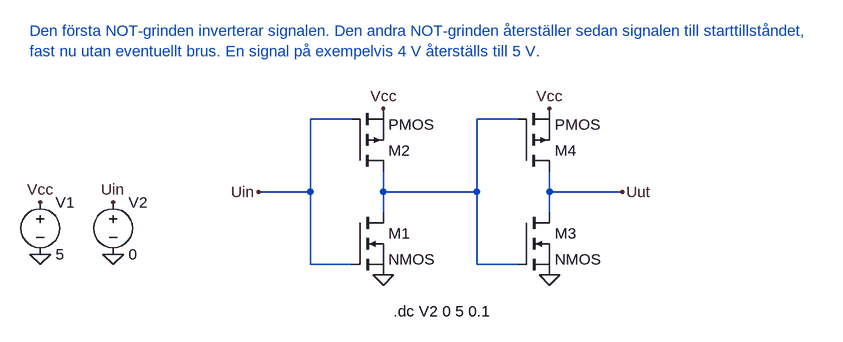
[diagram p0: schematic buffer.asc]
buffer.asc, the LTspice schematic file:
Version 4.1
SHEET 1 1132 680
WIRE 144 32 80 32
WIRE 400 32 336 32
WIRE 80 144 80 32
WIRE 80 144 0 144
WIRE 192 144 192 112
WIRE 336 144 336 32
WIRE 336 144 192 144
WIRE 448 144 448 112
WIRE 560 144 448 144
WIRE 192 176 192 144
WIRE 448 176 448 144
WIRE 80 256 80 144
WIRE 144 256 80 256
WIRE 336 256 336 144
WIRE 400 256 336 256
FLAG -336 160 Vcc
FLAG -336 240 0
FLAG 192 272 0
FLAG -224 240 0
FLAG 192 16 Vcc
FLAG 448 272 0
FLAG 448 16 Vcc
FLAG 560 144 Uut
FLAG -224 160 Uin
FLAG 0 144 Uin
SYMBOL nmos 144 176 R0
SYMATTR InstName M1
SYMBOL pmos 144 112 M180
SYMATTR InstName M2
SYMBOL voltage -336 144 R0
WINDOW 123 0 0 Left 0
WINDOW 39 0 0 Left 0
SYMATTR InstName V1
SYMATTR Value 5
SYMBOL voltage -224 144 R0
WINDOW 123 0 0 Left 0
WINDOW 39 0 0 Left 0
SYMATTR InstName V2
SYMATTR Value 0
SYMBOL nmos 400 176 R0
SYMATTR InstName M3
SYMBOL pmos 400 112 M180
SYMATTR InstName M4
TEXT 208 328 Left 2 !.dc V2 0 5 0.1
TEXT -352 -104 Left 2 ;Den första NOT-grinden inverterar signalen. Den andra NOT-grinden återställer sedan signalen till starttillståndet, \nfast nu utan eventuellt brus. En signal på exempelvis 4 V återställs till 5 V.

The netlist it stands for:
* buffer.asc
M1 N001 Uin 0 0 NMOS
M2 N001 Uin Vcc Vcc PMOS
V1 Vcc 0 5
V2 Uin 0 0
M3 Uut N001 0 0 NMOS
M4 Uut N001 Vcc Vcc PMOS
.model NMOS NMOS
.model PMOS PMOS
.lib standard.mos
.dc V2 0 5 0.1
* Den första NOT-grinden inverterar signalen. Den andra NOT-grinden återställer sedan signalen till starttillståndet,
* fast nu utan eventuellt brus. En signal på exempelvis 4 V återställs till 5 V.
.backanno
.end